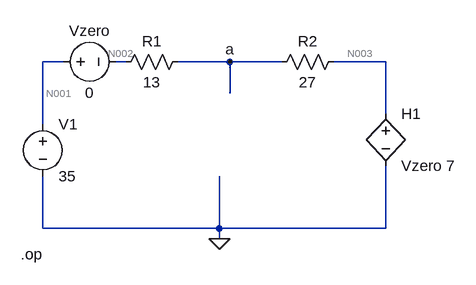
[diagram p0: schematic 1.asc]
1.asc, the LTspice schematic file:
Version 4
SHEET 1 880 680
WIRE 80 32 48 32
WIRE 176 32 160 32
WIRE 336 32 256 32
WIRE 416 32 336 32
WIRE 576 32 496 32
WIRE 336 80 336 32
WIRE 576 112 576 32
WIRE 48 128 48 32
WIRE 48 288 48 208
WIRE 320 288 320 208
WIRE 320 288 48 288
WIRE 576 288 576 192
WIRE 576 288 320 288
WIRE 320 304 320 288
FLAG 320 304 0
FLAG 336 32 a
SYMBOL res 160 48 R270
WINDOW 0 32 56 VTop 2
WINDOW 3 0 56 VBottom 2
SYMATTR InstName R1
SYMATTR Value 13
SYMBOL res 400 48 R270
WINDOW 0 32 56 VTop 2
WINDOW 3 0 56 VBottom 2
SYMATTR InstName R2
SYMATTR Value 27
SYMBOL h 576 96 R0
SYMATTR InstName H1
SYMATTR Value Vzero 7
SYMBOL voltage 64 32 R270
WINDOW 0 32 56 VTop 2
WINDOW 3 -32 56 VBottom 2
SYMATTR InstName Vzero
SYMATTR Value 0
SYMBOL voltage 48 112 R0
SYMATTR InstName V1
SYMATTR Value 35
TEXT 14 328 Left 2 !.op

The netlist it stands for:
* 1.asc
R1 N002 a 13
R2 a N003 27
H1 N003 0 Vzero 7
Vzero N001 N002 0
V1 N001 0 35
.op
.backanno
.end

* Results of the author's LTspice run, read from the files saved beside the schematic
* Operating Point:
*   V(n002) = 35 V
*   V(a) = 25.32 V
*   V(n003) = 5.213 V
*   V(n001) = 35 V
*   I(H1) = 744.7 mA
*   I(R2) = 744.7 mA
*   I(R1) = 744.7 mA
*   I(V1) = -744.7 mA
*   I(Vzero) = 744.7 mA